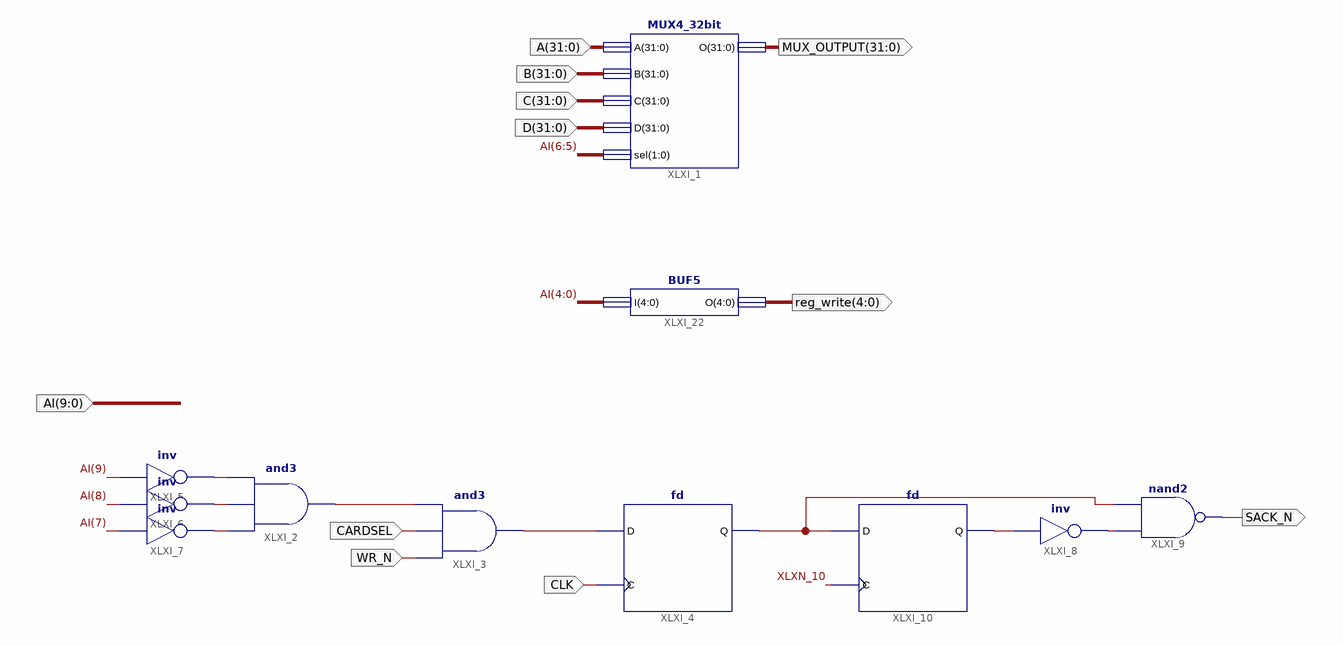
[diagram p0: schematic sheet 1]
// Xilinx ISE schematic Slave.sch (spartan6) as structural Verilog: 11 symbols, 11 ports
module Slave (
  input  CLK,
  input  CARDSEL,
  input  WR_N,
  input  [31:0] B,
  input  [31:0] C,
  input  [31:0] D,
  input  [31:0] A,
  input  [9:0] AI,
  output SACK_N,
  output [31:0] MUX_OUTPUT,
  output [4:0] reg_write
);

  wire x1, XLXN_1, XLXN_2, XLXN_3, XLXN_4, XLXN_5, XLXN_6, XLXN_7, XLXN_10;

  MUX4_32bit XLXI_1 (.A(A), .B(B), .C(C), .D(D), .sel(AI[6:5]), .O(MUX_OUTPUT));
  and XLXI_2 (XLXN_4, XLXN_3, XLXN_2, XLXN_1);
  and XLXI_3 (XLXN_5, WR_N, CARDSEL, XLXN_4);
  fd XLXI_4 (.C(CLK), .D(XLXN_5), .Q(x1));
  not XLXI_5 (XLXN_1, AI[9]);
  not XLXI_6 (XLXN_2, AI[8]);
  not XLXI_7 (XLXN_3, AI[7]);
  not XLXI_8 (XLXN_7, XLXN_6);
  nand XLXI_9 (SACK_N, XLXN_7, x1);
  fd XLXI_10 (.C(XLXN_10), .D(x1), .Q(XLXN_6));
  BUF5 XLXI_22 (.I(AI[4:0]), .O(reg_write));
endmodule
